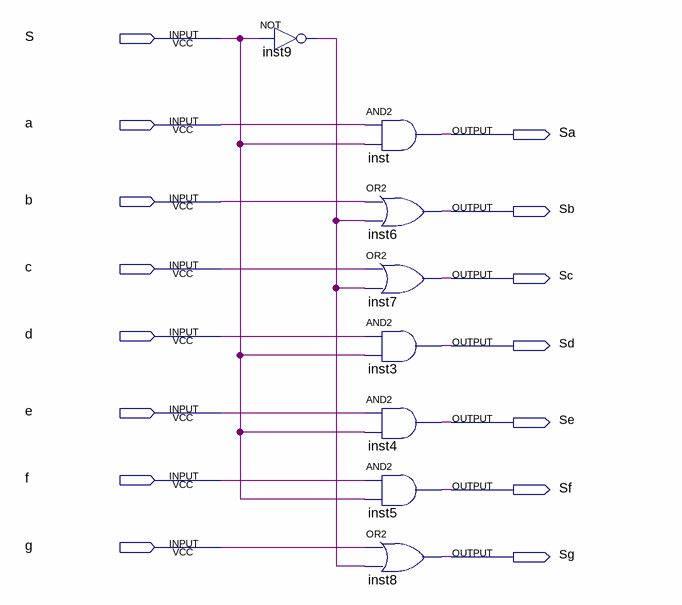
[diagram p0: schematic sheet]
// Quartus schematic BlockChoice.bdf as structural Verilog: 8 symbols, 15 pins
module BlockChoice (
  input  S,
  input  a,
  input  b,
  input  c,
  input  d,
  input  e,
  input  f,
  input  g,
  output Sa,
  output Sb,
  output Sc,
  output Sd,
  output Se,
  output Sf,
  output Sg
);

  wire inst9_out;

  not inst9 (inst9_out, S);
  and inst (Sa, a, S);
  or inst6 (Sb, b, inst9_out);
  or inst7 (Sc, c, inst9_out);
  and inst3 (Sd, d, S);
  and inst4 (Se, e, S);
  and inst5 (Sf, f, S);
  or inst8 (Sg, g, inst9_out);
endmodule
